# EAGLE board needles_2.5 (EAGLE 8.6.0)
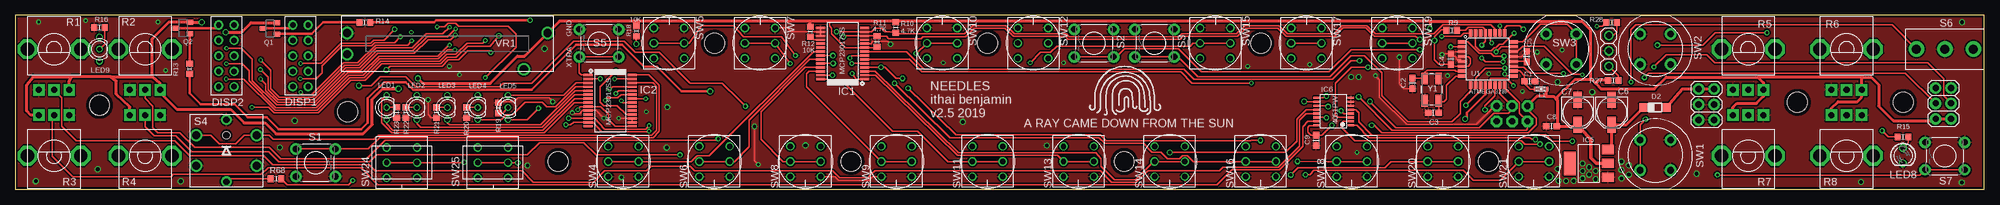
[diagram p2: board, top side]
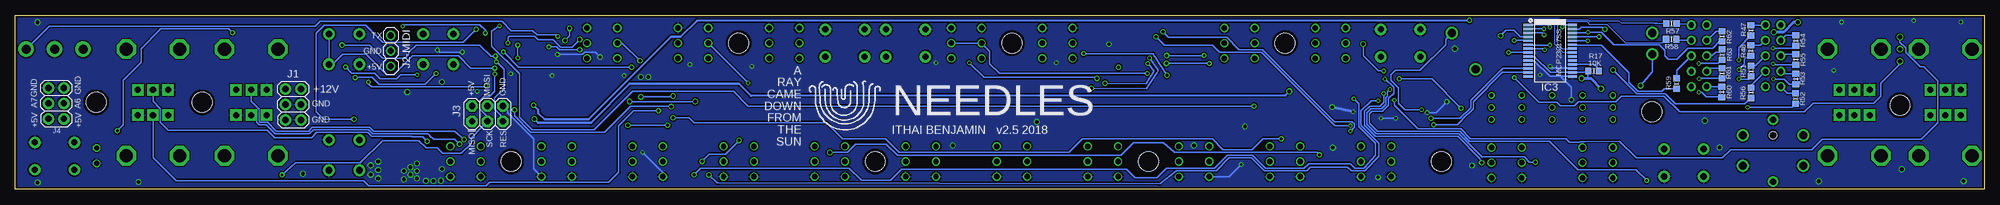
[diagram p3: board, bottom side, seen from below]

Size 324.4 x 28.7 mm. Coordinates in mm from the lower left corner, seen from the top.
Outline: 0,0 324.4,0 324.4,28.7 0,28.7 0,0
Copper layers (1*16): Top 0.0356mm / dielectric 1.5011mm / Bottom 0.0356mm
Design rules "LaenPCBOrder": minimum track width 6mil, minimum drill 13mil, track to track 6mil, track to pad 6mil, pad to pad 6mil, via to via 6mil, smd to smd 6mil, copper to edge 15mil, drill to drill 6mil, minimum pad ring 7mil, minimum via ring 7mil, stop-mask expansion 3mil, vias tented up to drill 0mil, thermal gap 10mil

## Footprints (pad centres in the part's own frame; a part is rotated, then mirrored left to right if it is on the bottom)
C0603 = smd 1.1 x 1: 1 -0.85,0; 2 0.85,0
PANASONIC_C = smd 2.6 x 1.4: + 2.05,0; - -2.05,0
SOD123 = smd 1.4 x 1.4: A 1.9,0; C -1.9,0
DISPLAY-HP_HDSP-E = drill 0.9 pad 1.5: 1 -1.27,5.08; 2 -1.27,2.54; 3 -1.27,0; 4 -1.27,-2.54; 5 -1.27,-5.08; 6 1.27,-5.08; 7 1.27,-2.54; 8 1.27,0; 9 1.27,2.54; 10 1.27,5.08
STAND-OFF = hole 3.302: 0,0
SSOP28 = smd 0.4 x 1.5: 1 -4.225,-3.625; 2 -3.575,-3.625; 3 -2.925,-3.625; 4 -2.275,-3.625; 5 -1.625,-3.625; 6 -0.975,-3.625; 7 -0.325,-3.625; 8 0.325,-3.625; 9 0.975,-3.625; 10 1.625,-3.625; 11 2.275,-3.625; 12 2.925,-3.625; 13 3.575,-3.625; 14 4.225,-3.625; 15 4.225,3.625; 16 3.575,3.625; 17 2.925,3.625; 18 2.275,3.625; 19 1.625,3.625; 20 0.975,3.625; 21 0.325,3.625; 22 -0.325,3.625; 23 -0.975,3.625; 24 -1.625,3.625; 25 -2.275,3.625; 26 -2.925,3.625; 27 -3.575,3.625; 28 -4.225,3.625
SOT223 = smd 1.499 x 2.007: 1 -2.261,-3.15; 2 0.025,-3.15; 3 2.311,-3.15 | smd 3.81 x 2.007: 4 0,3.15
TSSOP16 = smd 0.35 x 1: 1 -1.95,-2.825; 2 -1.3,-2.825; 3 -0.65,-2.825; 4 0,-2.825; 5 0.65,-2.825; 6 1.3,-2.825; 7 1.95,-2.825; 8 2.6,-2.825; 9 2.6,2.825; 10 1.95,2.825; 11 1.3,2.825; 12 0.65,2.825; 13 0,2.825; 14 -0.65,2.825; 15 -1.3,2.825; 16 -1.95,2.825
2X3 = drill 1.016 pad 1.88: 1 0,0; 2 0,2.54; 3 2.54,0; 4 2.54,2.54; 5 5.08,0; 6 5.08,2.54
1X03 = drill 1.016: 1 -2.54,0; 2 0,0; 3 2.54,0
2X3' = drill 1.016 pad 1.88 octagon: 1 0,0; 2 0,2.54; 3 2.54,0; 4 2.54,2.54; 5 5.08,0; 6 5.08,2.54
0603 = smd 0.85 x 0.7: 1 -0.9,0; 2 0.7,0
LED-BICOLOR-THROUGHHOLE = drill 0.7: 1 -2,0; 2 0,0; 3 2,0
LED3MM = drill 0.813 octagon: A -1.27,0; K 1.27,0
SOT23-3 = smd 0.8 x 1.1: 1 -0.95,-1.1; 2 0.95,-1.1; 3 0,1.2
ALPS_POT_VERTICAL = drill 1 pad 1.88 square: P$1 -2.5,6.7; P$2 0,6.7; P$3 2.5,6.7 | drill 2.2 pad 3.175 octagon: P$4 -4.4,0; P$5 4.4,0
R0603 = smd 1 x 1.1: 1 -0.85,0; 2 0.85,0
TACTILE-PTH = drill 1.016 pad 1.88: 1 -3.251,2.261; 2 3.251,2.261; 3 -3.251,-2.261; 4 3.251,-2.261
TACTILE_SWITCH_LED_PTH_12MM = drill 1.3 pad 1.93: 1 -5,2.5; 2 5,2.5; 3 -5,-2.5; 4 5,-2.5 | drill 1 pad 1.676: A 0,5.1; C 0,-5.1 | hole 1.2: 0,-2.5
ES_100SP1T6B11M2QEH_SMALL = drill 1.5 pad 2.54: O -4.7,0; P 0,0; S 4.7,0
D6R = drill 1.1 pad 1.93: A1 -2.5,2.5; A2 2.5,2.5; B1 -2.5,-2.5; B2 2.5,-2.5
LP4OA1PBCT = drill 0.9: P1 2.5,2.5; P2 0,2.5; P3 -2.5,2.5; P4 2.5,-2.5; P5 0,-2.5; P6 -2.5,-2.5
TQFP32-08 = smd 1.27 x 0.559: 1 -4.293,2.8; 2 -4.293,2; 3 -4.293,1.2; 4 -4.293,0.4; 5 -4.293,-0.4; 6 -4.293,-1.2; 7 -4.293,-2; 8 -4.293,-2.8; 17 4.293,-2.8; 18 4.293,-2; 19 4.293,-1.2; 20 4.293,-0.4; 21 4.293,0.4; 22 4.293,1.2; 23 4.293,2; 24 4.293,2.8 | smd 0.559 x 1.27: 9 -2.8,-4.293; 10 -2,-4.293; 11 -1.2,-4.293; 12 -0.4,-4.293; 13 0.4,-4.293; 14 1.2,-4.293; 15 2,-4.293; 16 2.8,-4.293; 25 2.8,4.293; 26 2,4.293; 27 1.2,4.293; 28 0.4,4.293; 29 -0.4,4.293; 30 -1.2,4.293; 31 -2,4.293; 32 -2.8,4.293
SLIDER-MEDIUM = drill 1.35: BOTTOM 16.5,1.75; P$4 12.6,-4.2; TOP -16.5,-1.75; WIPER -16.5,1.75
CRYSTAL-SMD-5X3.2-4PAD = smd 1.9 x 1.1: 1 -1.85,-1.15; 2 1.85,-1.15; 3 1.85,1.15; 4 -1.85,1.15

## Placement (x,y rotation side)
C1  100n  [C0603]  249.5,17.82 0 top
C2  22p  [C0603]  230.21,17.45 90 top
C3  22p  [C0603]  233.67,12.65 0 top
C4  100n  [C0603]  236.5,21.48 90 top
C5  100n  [C0603]  249.01,21.89 90 top
C6  22u  [PANASONIC_C]  263.01,12.7 270 top
C7  22u  [PANASONIC_C]  257.42,12.7 270 top
C8  100n  [C0603]  253.08,10.43 180 top
C9  100n  [C0603]  214.32,8.08 270 top
D2  1N5819HW  [SOD123]  270.15,13.49 0 top
DISP1  MIDI_CH  [DISPLAY-HP_HDSP-E]  47,22 0 top
DISP2  VALUES  [DISPLAY-HP_HDSP-E]  34.8,22 0 top
H1  STAND-OFF  [STAND-OFF]  89.45,4.6 0 top
H2  STAND-OFF  [STAND-OFF]  13.9,13.87 0 top
H3  STAND-OFF  [STAND-OFF]  54.76,12.8 0 top
H4  STAND-OFF  [STAND-OFF]  137.7,4.6 0 top
H5  STAND-OFF  [STAND-OFF]  242.7,4.6 0 top
H6  STAND-OFF  [STAND-OFF]  182.7,4.6 0 top
H7  STAND-OFF  [STAND-OFF]  160.2,24.1 0 top
H8  STAND-OFF  [STAND-OFF]  115.2,24.1 0 top
H9  STAND-OFF  [STAND-OFF]  205.2,24.1 0 top
H10  STAND-OFF  [STAND-OFF]  293.6,14.35 0 top
H11  STAND-OFF  [STAND-OFF]  311.05,14.35 0 top
IC1  MCP23017SS  [SSOP28]  136.33,22.38 90 top
IC2  MCP23017SS  [SSOP28]  98.02,14.63 270 top
IC3  MCP23017SS  [SSOP28]  71.52,22.86 270 bottom
IC5  REG1117  [SOT223]  259.25,4.27 90 top
IC6  4051PW  [TSSOP16]  217.2,12.5 90 top
J1  FEMALE 2x3  [2X3]  277.33,16.53 270 top
J2-MIDI  [1X03]  262.53,22.82 90 top
J3  ICSP  [2X3']  249.14,11.21 0 bottom
J4  FEMALE 2x3  [2X3]  316.38,16.71 270 top
L1  [0603]  251.28,16.54 180 top
LED1  LED-BICOLOR-THROUGHHOLE  [LED-BICOLOR-THROUGHHOLE]  61.2,13.5 90 top
LED2  LED-BICOLOR-THROUGHHOLE  [LED-BICOLOR-THROUGHHOLE]  66.2,13.5 90 top
LED3  LED-BICOLOR-THROUGHHOLE  [LED-BICOLOR-THROUGHHOLE]  71.2,13.5 90 top
LED4  LED-BICOLOR-THROUGHHOLE  [LED-BICOLOR-THROUGHHOLE]  76.2,13.5 90 top
LED5  LED-BICOLOR-THROUGHHOLE  [LED-BICOLOR-THROUGHHOLE]  81.2,13.5 90 top
LED8  [LED3MM]  311,5.55 270 top
LED9  LED-BICOLOR-THROUGHHOLE  [LED-BICOLOR-THROUGHHOLE]  13.9,23.1 90 top
Q1  [SOT23-3]  42.04,26.52 90 top
Q2  [SOT23-3]  27.68,26.57 90 top
R1  10K  [ALPS_POT_VERTICAL]  6.4,23.1 180 top
R2  10K  [ALPS_POT_VERTICAL]  21.4,23.1 180 top
R3  10K  [ALPS_POT_VERTICAL]  6.4,5.55 0 top
R4  10K  [ALPS_POT_VERTICAL]  21.4,5.55 0 top
R5  10K  [ALPS_POT_VERTICAL]  285.5,23.1 180 top
R6  10K  [ALPS_POT_VERTICAL]  301.7,23.1 180 top
R7  10K  [ALPS_POT_VERTICAL]  285.5,5.55 0 top
R8  10K  [ALPS_POT_VERTICAL]  301.7,5.55 0 top
R9  10K  [R0603]  236.66,26.2 180 top
R10  4.7K  [R0603]  145.07,26.67 90 top
R11  4.7K  [R0603]  141.99,24.35 270 top
R12  10K  [R0603]  130.98,25.97 90 top
R13  1K  [R0603]  28.74,19.87 270 top
R14  1K  [R0603]  57.61,27.51 0 top
R15  220  [R0603]  311,8.66 180 top
R16  220  [R0603]  13.89,26.67 0 top
R17  10K  [R0603]  64.36,19.53 180 bottom
R18  10K  [R0603]  102.31,26.06 90 top
R19  220ohm  [R0603]  79.6,13.43 270 top
R20  220ohm  [R0603]  74.37,12.65 90 top
R21  220ohm  [R0603]  69.39,12.65 90 top
R22  220ohm  [R0603]  64.36,12.65 90 top
R23  220ohm  [R0603]  62.83,12.66 90 top
R27  51OHM  [R0603]  263.27,17.94 180 top
R28  51OHM  [R0603]  263.01,27.47 180 top
R47  220ohm  [R0603]  38.46,26.21 270 bottom
R48  220ohm  [R0603]  38.47,22.88 270 bottom
R51  220ohm  [R0603]  38.45,19.5 270 bottom
R52  220ohm  [R0603]  31.09,14.96 270 bottom
R53  220ohm  [R0603]  31.06,18.21 270 bottom
R54  220ohm  [R0603]  31.06,24.51 270 bottom
R55  220ohm  [R0603]  31.07,21.41 270 bottom
R56  220ohm  [R0603]  38.45,15.91 90 bottom
R57  220ohm  [R0603]  51.54,27.31 180 bottom
R58  220ohm  [R0603]  51.58,24.73 180 bottom
R59  220ohm  [R0603]  50.68,17.44 270 bottom
R60  220ohm  [R0603]  43.24,16.07 270 bottom
R61  220ohm  [R0603]  43.23,19.14 270 bottom
R62  220ohm  [R0603]  43.2,25.24 270 bottom
R63  220ohm  [R0603]  43.22,22.21 270 bottom
R68  220ohm  [R0603]  42.97,1.77 180 top
S1  [TACTILE-PTH]  49.5,4.4 180 top
S2  [TACTILE-PTH]  177.7,24.1 0 top
S3  [TACTILE-PTH]  187.7,24.1 0 top
S4  [TACTILE_SWITCH_LED_PTH_12MM]  34.8,6.4 180 top
S5  [TACTILE-PTH]  96.18,24.1 0 top
S6  [ES_100SP1T6B11M2QEH_SMALL]  317.9,23.1 180 top
S7  [TACTILE-PTH]  317.9,5.5 0 top
SW1  D6R  [D6R]  270.2,5.65 90 top
SW2  D6R  [D6R]  270.2,23.1 270 top
SW3  D6R  [D6R]  254.7,23.1 270 top
SW4  LP4OA1PBCT  [LP4OA1PBCT]  100.2,4.6 90 top
SW5  LP4OA1PBCT  [LP4OA1PBCT]  107.7,24.1 270 top
SW6  LP4OA1PBCT  [LP4OA1PBCT]  115.2,4.6 90 top
SW7  LP4OA1PBCT  [LP4OA1PBCT]  122.7,24.1 270 top
SW8  LP4OA1PBCT  [LP4OA1PBCT]  130.2,4.6 90 top
SW9  LP4OA1PBCT  [LP4OA1PBCT]  145.2,4.6 90 top
SW10  LP4OA1PBCT  [LP4OA1PBCT]  152.7,24.1 270 top
SW11  LP4OA1PBCT  [LP4OA1PBCT]  160.2,4.6 90 top
SW12  LP4OA1PBCT  [LP4OA1PBCT]  167.7,24.1 270 top
SW13  LP4OA1PBCT  [LP4OA1PBCT]  175.2,4.6 90 top
SW14  LP4OA1PBCT  [LP4OA1PBCT]  190.2,4.6 90 top
SW15  LP4OA1PBCT  [LP4OA1PBCT]  197.7,24.1 270 top
SW16  LP4OA1PBCT  [LP4OA1PBCT]  205.2,4.6 90 top
SW17  LP4OA1PBCT  [LP4OA1PBCT]  212.7,24.1 270 top
SW18  LP4OA1PBCT  [LP4OA1PBCT]  220.2,4.6 90 top
SW19  LP4OA1PBCT  [LP4OA1PBCT]  227.7,24.1 270 top
SW20  LP4OA1PBCT  [LP4OA1PBCT]  235.2,4.6 90 top
SW21  LP4OA1PBCT  [LP4OA1PBCT]  250.2,4.6 90 top
SW24  LP4OA1PBCT  [LP4OA1PBCT]  63.7,4.4 90 top
SW25  LP4OA1PBCT  [LP4OA1PBCT]  78.7,4.4 90 top
U1  ATMEGA328P  [TQFP32-08]  242.6,21.49 0 top
VR1  10k  [SLIDER-MEDIUM]  71.2,24 0 top
Y1  16MHz  [CRYSTAL-SMD-5X3.2-4PAD]  233.37,16.46 270 top

## Tracks (layer width: path | path; a pad name or v marks a point on that pad's centre or on a via)
4T  (via drill 0.35)
  Top 0.254: 247,17 247,17.1 v246.8,17.1 245.71,18.29 243.09,18.29 243,18.2 U1.13 | v266.2,17.7 266.2,26.3 267,27.1 309.2,27.1 S6.S
  Bottom 0.254: v266.2,17.7 266.2,17.3 265.7,16.9 247,16.9 v246.8,17.1
+5V  (via drill 0.35, 0.51, 0.61, 0.65)
  Top 0.254: IC2.15 101.24,10.41 98.84,10.41 97.74,11.51 97.74,12.34 96.42,13.66 IC2.9 93.08,13.65 v92.71,13.11 | R11.2 141.69,23.36 IC1.9 136.79,23.36 134.52,25.63 134.52,26.57 134.16,26.92 134.16,27.74 | U1.4 239.37,21.89 239.77,21.49 239.77,20.66 239.41,20.3 U1.6 237.14,20.29 C4.1 234.53,20.63 233.83,21.34 v233.83,24.54 233.83,25.18 234.97,26.33 235.69,26.33 R9.2 | J3.2 249.14,13.19 250.59,11.73 250.59,10.67 249.27,9.35 225.14,9.35 223.93,10.56 v223.47,10.56 | v216.92,10.55 215.29,8.93 C9.1 213.47,8.93 212.95,9.45 212.95,10.21 213.25,10.52 214.34,10.52 IC6.16 | v233.07,26.52 233.07,27.71 | R18.2 102.31,27.13
  Top 0.508: R1.P$1 8.9,17.84 9.34,18.59 | 15.74,18.59 9.34,18.59 | 15.74,18.59 22.6,18.59 | 22.6,18.59 23.82,17.53 23.82,16.48 R2.P$1 23.9,15.92 26.64,13.18 35.48,13.18 37.69,10.97 41.15,10.97 42.98,9.14 57.3,9.14 58.83,10.67 58.83,14.89 60.55,16.61 v63.14,16.61 | R3.P$1 2.58,12.25 1.88,12.95 1.88,17.22 2.94,18.59 9.34,18.59 | R4.P$1 18.9,13.61 16.66,15.7 16.66,17.83 15.74,18.59 | L1.1 252.18,15.33 | 252.18,15.33 250.71,15.33 J3.2 | R6.P$1 304.2,15.2 303.48,14.48 300.3,14.48 299.21,13.39 R8.P$1 | R7.P$1 283,13.51 283.66,14.17 286.86,14.17 288,15.31 R5.P$1 288,17.6 287.1,18.5 | 130.98,27.74 134.16,27.74 144.85,27.74 R10.2 145.25,27.71 233.07,27.71 258.09,27.71 259.61,26.19 259.61,18.21 | 22.6,18.59 22.6,24.81 25.38,27.58 28.61,27.58 Q2.2 v30.72,27.52 v30.73,27.53 | 254.1,14.71 254.1,15.24 257,18.14 259.54,18.14 259.61,18.21 | 254.1,14.71 254.1,10.41 254.04,10.34 C8.1 257.21,10.43 C7.+ | 252.18,15.33 253.48,15.33 254.1,14.71 | R6.P$1 304.2,17.43 | 263.79,16.57 264.16,16.57 | 264.16,16.57 270.06,16.57 271.99,18.5 287.1,18.5 | J4.6 J4.5 316.08,11.33 309.42,11.33 307.01,13.74 307.01,17.25 305.75,18.5 304.39,18.5 | v34.67,25.91 37.31,25.91 38.86,27.46 43.13,27.46 Q1.2 | v66.34,18.29 67.15,17.48 78.26,17.48 82.73,21.95 83.9,21.95 VR1.BOTTOM 89.69,27.74 102.34,27.74 | 130.98,27.74 102.34,27.74 | R12.2 130.98,27.74 | 102.34,27.74 102.31,27.71 R18.2 | 304.39,18.5 287.1,18.5 | R6.P$1 304.2,18.31 304.39,18.5 | 264.16,16.57 264.15,16.56 261.26,16.56 260.36,17.46 | 260.36,17.46 259.61,18.21 | R27.2 260.85,17.95 260.36,17.46
  Top 0.61: C7.+ 259.58,8.18 259.58,5.18 260.47,4.29 IC5.2
  Bottom 0.254: IC3.9 74.09,21.89 71.48,19.28 IC3.16 | IC3.16 65.88,19.29 65.42,19.45 | 65.42,19.45 R17.2 | v92.71,13.11 95.45,13.11 96.52,14.17 96.52,16.76 97.74,17.98 97.74,18.9 97.03,19.61 92.96,19.61 88.74,23.83 88.74,24.71 VR1.BOTTOM | v223.47,10.56 v216.92,10.55 | v233.83,24.54 233.07,25.3 v233.07,26.52 | 65.28,18.29 65.28,19.3 65.42,19.45
  Bottom 0.406: IC3.16
  Bottom 0.508: v66.34,18.29 65.28,18.29 64.82,18.29 v63.14,16.61 | v30.73,27.53 31.44,27.53 33.05,25.92 34.66,25.92 v34.67,25.91
A
  Top 0.254: SW6.P2 SW6.P5 118.49,4.6 120.9,7.01 120.9,11.43 130.88,21.41 IC1.23
A4  (via drill 0.38, 0.51)
  Top 0.254: SW18.P5 SW18.P2 216.17,4.6 v211.25,4.62 | v147.11,16.66 154.96,8.97 178.77,8.97 179.68,8.05 203.58,8.05 203.6,8.08 v205.13,8.08 | 139.94,22.05 IC1.7 137.87,22.06 v137.53,21.65
  Bottom 0.254: v147.11,16.66 138.02,16.62 137.43,17.46 137.13,17.95 136.27,19.24 136.26,19.24 136.27,19.25 136.45,18.95 136.33,19.15 136.15,19.44 136.14,19.7 v137.53,21.65 | v137.53,21.65 137.49,21.66 137.51,21.64 | 137.51,21.65 v137.53,21.65 | v205.13,8.08 205.13,8.05 207.39,5.79 210.07,5.79 v211.25,4.62
A#  (via drill 0.43, 0.51)
  Top 0.254: SW7.P5 SW7.P2 | SW7.P2 | SW7.P2 v127.67,20.75 | v134.77,20.76 IC1.24
  Bottom 0.203: 134.78,20.75 v134.77,20.76
  Bottom 0.254: v127.67,20.75 134.78,20.75
A#4  (via drill 0.51)
  Top 0.254: SW19.P2 SW19.P5 | IC1.8 145.89,22.71 146.8,22.71 149.7,19.81 192.53,19.81 194.15,18.19 217.03,18.19 220.03,21.18 v221.49,21.18
  Bottom 0.254: v221.49,21.18 224.4,24.1 SW19.P5
ADC6  (via drill 0.45)
  Top 0.254: U1.19 247.04,20.14 248.54,20.14 249.58,19.1 v255.04,19.1 | v268.4,18.41 269.14,19.15 311.4,19.15 J4.3
  Bottom 0.254: v268.4,18.41 268.5,18.41 268.53,18.44 265.6,18.44 264.46,17.31 256.84,17.31 v255.04,19.1
ADC7  (via drill 0.35, 0.45)
  Top 0.254: U1.22 247.41,22.69 248.34,23.62 251.89,23.62 256.51,19 258.06,19 v258.17,18.9 | v269.98,20.17 269.98,20.19 271.98,22.2 278.69,22.2 280.01,20.88 315.09,20.88 317.7,18.26 317.7,15.39 J4.4
  Bottom 0.254: v258.17,18.9 260.88,18.9 261.54,18.24 264.31,18.24 265.2,19.13 268.94,19.13 v269.98,20.17
AREF
  Top 0.254: U1.20 248.96,21.09 C5.1
ARP_LED  (via drill 0.35)
  Top 0.254: v97.2,14.71 97.58,15.09 99.26,15.09 99.78,15.61 IC2.23
  Bottom 0.254: 97.28,14.78 v97.2,14.71 97.2,13.84 93.32,9.96 86.26,9.96 84.64,8.33 84.63,8.33 68.92,8.33 68.36,7.78 68.17,7.77 66.65,7.8 66.59,7.85 65.81,7.85 65.77,7.82 60.09,7.92 57.35,5.18 43.13,5.18 41.76,6.55 28.39,6.55 26.72,8.23 10.41,8.23 7.68,10.96 7.68,17.91 9.97,20.2 10.57,20.2 12.96,22.6 12.96,23.31 13.9,24.24 LED9.3
B
  Top 0.254: IC1.25 132.33,20.1 130.15,20.1 122.86,12.82 122.86,8.25 126.51,4.6 SW8.P2 SW8.P5
B4  (via drill 0.35, 0.51)
  Top 0.254: SW20.P5 SW20.P2 226.67,4.6 225.68,3.61 211.35,3.61 v210.13,2.39 | IC2.21 100.17,14.31 v99.86,14.62
  Bottom 0.254: v99.86,14.62 101,14.62 102.66,12.95 102.66,10.53 99.72,7.58 99.72,5.49 102,3.05 102.3,3.05 102.31,3.05 104.29,3.05 104.89,3.66 111,3.66 111.6,3.05 118.62,3.05 120.75,5.18 124.41,5.18 126.54,3.05 133.09,3.05 133.1,3.05 135.84,0.91 208.51,1.06 208.81,1.06 v210.13,2.39
C
  Top 0.254: SW9.P5 SW9.P2 130.35,16.95 130.35,19.05 130.76,19.46 IC1.26
C4  (via drill 0.35, 0.51)
  Top 0.254: SW21.P5 SW21.P2 244.65,1.55 240.23,1.55 238.61,3.17 214,3.17 213.26,2.44 v212.57,2.44 | IC2.22 101.66,14.94 v103.88,14.94
  Bottom 0.254: v103.88,14.94 103.07,14.13 103.07,10.36 100.28,7.57 100.28,5.64 102.1,3.61 102.2,3.5 103.68,3.5 104.44,4.27 111.3,4.27 112.06,3.5 118.46,3.5 120.6,5.64 124.71,5.64 126.84,3.5 134.72,3.5 136.29,1.93 139.9,1.93 141.32,3.35 178.36,3.35 180.18,1.47 184.99,1.47 187.04,3.5 211.5,3.5 v212.57,2.44
C#  (via drill 0.41, 0.51)
  Top 0.254: SW10.P2 SW10.P5 v148.4,22.38 | v134.66,18.8 IC1.27
  Bottom 0.254: v148.4,22.38 136.95,22.35 136.7,21.95 136.65,21.84 v134.66,18.8
D
  Top 0.254: SW11.P5 SW11.P2 153.64,4.6 148.64,9.6 144.52,9.6 136.6,17.53 134.46,17.53 133.85,18.14 132.72,18.14 IC1.28
D10  (via drill 0.51)
  Top 0.254: U1.14 243.8,15.46 242.15,13.8 v242.15,13.13 | IC6.11 216.15,13.8 v216.3,13.65
  Bottom 0.254: v216.3,13.65 216.38,13.73 223.01,13.73 227.29,9.45 239.5,9.45 242.15,12.1 242.15,12.66 v242.15,13.13
D#  (via drill 0.38)
  Top 0.254: v137.87,19.1 138.5,18.16 IC1.1
  Bottom 0.254: v137.87,19.1 162.25,19.1 163.88,20.73 163.88,22.78 SW12.P5 SW12.P2
E
  Top 0.254: SW13.P5 SW13.P2 171.69,5.62 155.28,5.62 155.28,5.63 141.77,18.81 IC1.2
EUC_LED  (via drill 0.35)
  Top 0.254: v77.44,18.41 82.49,23.46 82.49,25.58 81.22,26.84 73.06,26.84 72.54,27.36 71.31,27.36 70.73,26.77 v69.52,26.77
  Bottom 0.254: LED9.1 13.9,20.62 17.07,17.45 17.07,15.37 18.21,14.22 28.19,14.22 29.64,12.78 50.16,12.78 52.76,15.38 59.8,15.38 60.71,14.48 66.85,14.48 67.54,13.79 69.85,13.79 70.43,14.38 73.41,14.38 v77.44,18.41 | IC3.28 69.21,27.09 v69.52,26.77
F
  Top 0.254: 189.18,4.6 SW14.P5 SW14.P2 187.56,4.6 184.58,1.63 181.1,1.63 178.88,3.84 178.88,5.09 178.07,6.02 155.44,6.03 141.69,19.45 IC1.3
F#  (via drill 0.35, 0.51)
  Top 0.254: SW15.P2 SW15.P5 194.05,24.09 193.58,23.62 171.65,23.62 170.58,22.55 168.91,22.55 v167.23,20.88 | IC1.4 v142.64,20.12 143.3,20.12 145.13,18.29 v146.2,18.29
  Bottom 0.254: v146.2,18.29 146.35,18.44 164.79,18.44 v167.23,20.88
G
  Top 0.203: IC1.21
  Top 0.254: IC1.21 131.49,22.7 114.34,5.55 112.31,5.55 111.35,4.6 SW4.P5 SW4.P2
G4  (via drill 0.38, 0.51)
  Top 0.254: SW16.P5 SW16.P2 194.11,4.59 193.69,5 193.09,5.55 192.31,5.55 191.78,5.03 189.85,5.03 188.74,6.15 187.31,6.15 185.86,7.59 179.53,7.59 178.58,8.53 154.02,8.53 v144.88,17.48 | v137.81,20.75 IC1.5
  Bottom 0.254: v144.88,17.48 138.1,17.42 136.76,19.44 137.63,20.59 v137.81,20.75
G#  (via drill 0.43, 0.51)
  Top 0.203: v134.71,22.05 133.41,22.05
  Top 0.254: SW5.P5 SW5.P2 111,24.1 113.11,26.98 118.31,26.98 120,25.13 120.6,25.13 126.25,25.13 v128.54,22.06 | 133.41,22.05 IC1.22
  Bottom 0.254: v128.54,22.06 v134.71,22.05
G#4  (via drill 0.35)
  Top 0.254: SW17.P2 SW17.P5 | IC1.6 145.44,21.41 147.35,21.41 149.4,19.36 192.07,19.36 193.9,17.53 v203.65,17.53
  Bottom 0.254: SW17.P5 203.65,17.55 v203.65,17.53
GND  (via drill 0.35, 0.36, 0.4, 0.41, 0.46, 0.51, 0.55, 0.6, 0.65)
  Top 0.254: IC2.16 IC2.17 99.44,11.71 v99.41,11.73 | v91.79,12.65 91.97,12.47 92.97,12.47 93.5,13.01 IC2.10 95.7,13.01 v96.97,11.73 | SW7.P3 127.23,26.6 127.87,25.96 IC1.16 | IC1.15 IC1.16 | IC1.16 IC1.17 | SW8.P6 135.04,2.1 135.64,1.5 140.65,1.5 141.25,2.1 SW9.P3 | C4.2 237.17,22.69 U1.3 | U1.5 238.06,21.34 237.55,21.34 237.39,21.5 237.39,21.75 C4.2 | R21.1 68.56,11.8 68.02,12.34 v68.02,14.78 | C4.2 236.27,22.33 | v144.22,23.93 143.76,24.38 141.35,24.38 140.97,24.01 IC1.10 | C4.2 235.13,22.33 v235.05,22.25 | C2.1 228.81,16.6 228.04,17.37 v228.04,21.79 | v224.08,18.75 224.74,18.09 224.74,15.22 229.24,10.72 240.75,10.72 243.78,13.75 J3.6 | v122.42,4.12 121.81,4.72 v121.81,10.36 | U1.21 248.16,21.89 C5.2 | 79.75,14.43 82.23,14.43 82.88,15.09 87.93,15.09 v88.57,14.45
  Top 0.508: R19.1 79.75,14.43
  Bottom 0.254: IC3.10 74.2,21.23 71.6,18.64 69.85,18.64 | 69.85,18.64 IC3.15 | v99.41,11.73 v96.97,11.73 96.82,11.73 | v68.02,14.78 68.02,16.81 69.85,18.64 | SW20.P6 239.01,3.41 239.01,8.38 243.28,12.65 243.28,12.97 J3.6 | v228.04,21.79 228.8,22.55 230.59,22.55 230.9,22.25 v235.05,22.25 | SW18.P3 217.7,2.77 v221.03,6.1 | SW8.P3 124.44,2.1 v122.42,4.12 | v250.7,22.6 254.46,22.6 v254.81,22.96 | v88.57,14.45 90.37,12.65 v91.79,12.65
  Bottom 0.305: IC3.17 71.19,19.93 v71.52,20.27 71.68,20.42
  Bottom 0.508: v103.98,12.8 v107.44,13.56
  other vias: 258.21,4.27 258.21,3.05 258.21,1.83 259.28,3.66 259.28,2.44 264.61,4.57 264.61,3.2 264.61,1.83 304.09,1.22 277.01,2.59 265.83,2.44 265.83,3.96 254.1,17.68 220.09,18.51 221.31,18.51 87.23,23.18 73.2,18.9 3.86,27.58 23.52,27.58 11.63,27.81 3.4,1.37 27.3,1.35 156.11,11.13 260.35,1.68 260.35,3.05 254.26,1.43 254.1,3.35 259.81,16.03 248.31,16.15 213.26,20.57 203.04,20.27 172.72,20.88 152.9,20.88 46.07,11.3 235.96,18.75 256.74,1.41 255.5,1.4 99.87,1.98 84.42,3.92 43.62,6.92 169.92,7.22 242.76,19.05 320.71,1.13 320.73,27.53 13.61,3.33 24.79,19.61 130.2,7.26 107.34,6.88
  pour Top (isolate 0.254): 0,28.7 324.4,28.7 324.4,0 0,0
  pour Bottom (isolate 0.203): 0,0 0,28.7 324.4,28.7 324.4,0
LEG_LED  (via drill 0.41, 0.45, 0.51)
  Top 0.254: U1.1 239.32,24.29 241.21,22.4 243.13,22.4 243.58,21.95 v245.26,21.95 | v270.56,23.77 278.02,23.77 280.08,25.83 280.11,25.81 v288.6,25.81 | v307.57,9.65 308.56,8.66 R15.2
  Bottom 0.254: v245.26,21.95 246.02,21.95 247.85,23.77 258.37,23.77 259.58,22.55 259.58,22.25 260.19,21.64 263.85,21.64 265.99,23.77 v270.56,23.77 | v288.6,25.81 289.23,26.44 300.41,26.44 303.66,23.19 303.66,20.95 306.6,18.01 306.6,10.62 v307.57,9.65
MCP_SCL  (via drill 0.35, 0.41, 0.45, 0.46, 0.51)
  Top 0.254: v104.44,10.52 103.85,9.93 101.55,9.93 99.45,9.92 99.25,9.92 97.12,9.92 95.47,11.71 IC2.12 v91.18,11.73 | v231.39,24.69 230.69,25.24 223.89,25.24 222.53,26.59 218.77,26.59 217.41,25.24 209.39,25.24 208.06,26.57 202.76,26.57 201.38,25.2 192.39,25.2 191.93,24.73 173.47,24.73 173.01,25.2 164.47,25.2 163.1,26.57 157.99,26.57 156.56,25.15 149.55,25.15 149.25,24.84 143.91,24.84 143.55,25.2 R11.1 141.73,25.31 IC1.12 136.61,25.31 v136.45,25.15 | U1.28 243,24.34 v243.23,24.11
  Bottom 0.254: v136.45,25.15 135.07,23.77 127.15,23.77 125.98,22.61 119.09,22.61 107,10.52 v104.44,10.52 | IC3.12 76.86,19.94 79.35,19.94 84.61,14.68 84.61,13.47 86.36,11.72 89.97,11.73 v91.18,11.73 | v231.39,24.69 232.66,23.42 234.54,23.42 235.81,24.69 238.28,24.69 238.81,25.22 243,25.22 243.23,25 v243.23,24.11
MCP_SDA  (via drill 0.35, 0.45, 0.46)
  Top 0.254: 99.09,9.52 99.08,9.52 96.64,9.52 95.24,11.06 IC2.13 91.96,11.05 91.49,10.67 v90.73,10.67 | 99.09,9.52 | 99.09,9.52 99.24,9.52 99.64,9.52 101.55,9.52 104.34,9.52 104.42,9.6 v104.44,9.6 | 139.98,25.96 IC1.13 | IC1.13 141.07,25.96 141.63,26.52 142.74,26.52 143.3,25.96 144.12,25.96 R10.1 145.28,25.6 156.41,25.6 157.78,26.98 163.27,26.98 164.64,25.6 173.17,25.6 173.63,25.15 173.94,25.15 173.94,25.14 191.76,25.14 192.22,25.6 201.22,25.6 202.59,26.98 208.23,26.98 209.56,25.65 217.25,25.65 218.6,27 222.7,27 224.05,25.65 233.72,25.65 235.2,27.13 243.13,27.13 243.8,26.46 U1.27 | IC1.13 v135.31,25.96 v135.31,25.95
  Bottom 0.254: v104.44,9.6 104.44,9.62 103.81,10.25 103.81,10.78 104.18,11.15 107.06,11.15 118.92,23.01 122.76,23.01 124.81,25.05 126.17,25.05 126.18,25.06 134.38,25.06 v135.31,25.95 | IC3.13 76.56,19.3 79.36,19.3 84.2,14.45 84.2,13.3 85.95,11.55 86.07,11.43 86.84,10.67 v90.73,10.67
MIDI_CH
  Top 0.254: S1.4 S1.3 58.17,6.66 60.05,8.53 105.05,8.53 106.07,9.55 106.07,17.13 104.33,18.87 101.65,18.87 IC2.28
MIDI_CH_COM  (via drill 0.5, 0.51)
  Top 0.406: R14.2 68.99,27.51 69.33,27.86 71.47,27.86 74.4,27.84 84.84,27.84 v84.85,27.85 | v239.01,13.87 241.4,16.25 U1.11
  Bottom 0.254: v239.01,13.87 239.16,14.02
  Bottom 0.406: v84.85,27.85 212.09,27.8 214.76,25.13 216.32,25.13 229.92,11.53 237.21,11.53 238.25,12.57 238.25,13.11 v239.01,13.87
MIDI_OUT  (via drill 0.35, 0.46)
  Top 0.254: v246.94,25.76 245.08,23.9 244.5,23.9 243.92,23.33 243.68,23.33 243.23,22.87 241.31,22.87 240.6,23.59 U1.31 | R28.2 261.98,27.4 261.44,26.86 v260.58,26.86
  Bottom 0.254: 246.94,25.6 v246.94,25.76 246.94,26.21 247.85,27.13 260.31,27.13 v260.58,26.86
MISO  (via drill 0.51)
  Top 0.254: U1.16 245.4,16.68 247.82,14.26 247.82,12.53 J3.1 249.14,9.98 248.92,9.75 230.32,9.75 226.82,9.75 v221.33,15.24 | v216,15.39 215.54,15.09 214.39,15.09 IC6.9
  Bottom 0.254: v221.33,15.24 216.3,15.24 v216,15.39
MOSI  (via drill 0.51, 0.6)
  Top 0.254: U1.15 244.6,15.76 J3.4 246.61,13.13 246.01,12.53 243.62,12.53 241.25,10.16 227.48,10.16 v223.16,14.48 | v212.34,14.48 214.35,14.48 IC6.10
  Bottom 0.254: v223.16,14.48 v212.34,14.48 212.19,14.48
N$1
  Top 0.254: R12.1 131.64,24.66 IC1.18
N$2  (via drill 0.45, 0.55)
  Top 0.254: IC2.18 100.63,12.36 99.19,13.8 96.91,13.8 96.36,14.34 96.36,16.92 v98.95,19.51 | R18.1 102.31,25.74 v102.31,23.93
  Bottom 0.254: 98.8,19.36 v98.95,19.51 99.82,19.51 102.31,21.99 v102.31,23.93
N$3
  Top 0.254: L1.2 249.64,16.52 248.65,17.51 C1.1 248.65,18.71 247.85,19.51 246.9,19.51 U1.18
N$4
  Top 0.254: R23.2 LED1.2
N$5
  Top 0.254: C2.2 Y1.1 232.22,19.27 232.61,19.66 237.17,19.66 237.33,19.49 U1.7
N$6
  Top 0.254: C3.2 Y1.3 234.37,14.45 235.4,14.45 235.81,14.86 235.81,17.17 237.31,18.68 238.29,18.68 U1.8
N$7
  Top 0.254: R22.2 66.22,13.52 LED2.2
N$8
  Bottom 0.254: IC3.18 64.27,20.59 63.34,19.66 63.34,19.25
  Bottom 0.406: 63.34,19.25 R17.1
N$9
  Top 0.254: R21.2 LED3.2
N$10
  Top 0.254: R20.2 LED4.2
N$11
  Top 0.254: R19.2 80.28,12.58 LED5.2
N$12
  Top 0.254: R68.2 35.27,1.77 S4.A
N$13
  Top 0.254: J2-MIDI.1 264.12,18.68 R27.1
N$17
  Top 0.406: R14.1 50.72,27.51 48.86,25.65 43.22,25.65 Q1.1
N$18
  Top 0.254: J2-MIDI.3 263.31,25.36 263.86,25.91 R28.1
N$20
  Top 0.406: R13.1 28.74,25.59 Q2.1
N$21
  Top 0.254: LED8.A 311.85,7.67 R15.1
N$22
  Top 0.406: DISP2.1 33.02,26.57 Q2.3
N$23
  Top 0.254: LED9.2 14.74,23.94 R16.2
N$29
  Bottom 0.254: R47.1 38.44,27.08 DISP2.10
N$30
  Bottom 0.254: DISP2.9 36.88,23.73 R48.1
N$31
  Bottom 0.254: DISP2.8 37.72,20.35 R51.1
N$32
  Bottom 0.254: R52.1 32.42,15.81 DISP2.5
N$33
  Bottom 0.254: R53.1 33.13,19.06 DISP2.4
N$34
  Bottom 0.254: R54.1 32.71,25.36 DISP2.2
N$35
  Bottom 0.254: R55.1 33.27,22.26 DISP2.3
N$36
  Bottom 0.203: R57.1 48.49,27.3 DISP1.10
N$37
  Bottom 0.254: DISP2.7 38.45,17.09 R56.2
N$38
  Top 0.406: Q1.3 45.17,26.52 DISP1.1
N$39
  Bottom 0.254: DISP1.9 50.54,24.54 R58.1
N$40
  Bottom 0.254: R59.1 50.68,19.59 DISP1.8
N$41
  Bottom 0.254: R60.1 DISP1.5
N$42
  Top 0.508: J1.1 274.63,16.53 | 274.63,16.53 D2.A | J1.2 J1.1 | J1.1 274.63,16.53
N$43
  Bottom 0.254: R61.1 45.2,19.99 DISP1.4
N$44
  Bottom 0.254: R62.1 44.18,26.09 DISP1.2
N$45
  Bottom 0.254: DISP1.3 44.88,22 44.25,22.63 43.65,22.63 R63.1
OCT_DOWN  (via drill 0.35, 0.51)
  Top 0.254: SW24.P2 SW24.P5 73.89,4.4 v73.96,4.47 | IC2.25 98.39,16.91 v97.94,16.46
  Bottom 0.254: v73.96,4.47 74.92,4.47 75.81,5.35 82.73,5.35 82.77,5.32 82.81,5.4 82.88,5.43 86.59,9.14 100.13,9.14 101.71,10.72 101.71,12.64 101.09,13.26 99.31,13.26 98.55,14.02 98.55,15.16 98.32,15.38 98.32,16.07 v97.94,16.46
OCT_LED1  (via drill 0.45, 0.46)
  Top 0.254: v96.41,18.22 94.41,18.22 IC2.2 | LED5.1 84.33,11.5 v86.21,13.38
  Bottom 0.254: v96.41,18.22 v96.4,18.22 91.04,18.22 v86.21,13.39 v86.21,13.38
OCT_LED2
  Top 0.254: LED5.3 90.32,15.5 92.37,17.55 IC2.3
OCT_LED3
  Top 0.254: LED4.1 80.06,11.5 80.87,12.31 81.66,12.31 81.93,12.31 84,14.38 86.79,14.38 87.53,13.64 89.04,13.64 92.29,16.9 94.38,16.9 IC2.4
OCT_LED4
  Top 0.254: LED3.1 71.2,10.99 71.57,10.62 86.59,10.62 92.23,16.25 IC2.5
OCT_LED5
  Top 0.254: LED2.1 66.2,10.81 66.8,10.21 86.8,10.21 92.19,15.6 IC2.6
OCT_LED6
  Top 0.254: LED1.1 61.2,10.78 62.23,9.75 86.92,9.75 92.12,14.96 IC2.7
OCT_LED7
  Top 0.254: IC2.8 92.07,14.3 87.12,9.35 62.02,9.35 60.39,10.98 60.39,14.69 LED1.3
OCT_UP  (via drill 0.35, 0.51)
  Top 0.254: SW25.P2 SW25.P5 82.22,4.4 v82.8,4.39 | IC2.24 99.41,16.26 v98.95,15.8
  Bottom 0.254: v82.8,4.39 83.11,5.08 86.76,8.74 100.3,8.74 102.11,10.56 102.11,12.84 101.24,13.72 99.56,13.72 98.95,14.33 v98.95,15.8
OSC  (via drill 0.35)
  Top 0.254: U1.32 239.71,25.7 238.7,25.7 238.2,25.2 v235,25.2
  Bottom 0.254: v235,25.2 235.25,25.45 238.4,25.45 239.13,26.18 242.68,26.18 244.17,27.66 274.19,27.66 274.98,26.87 318.83,26.87 S6.O
POT_MUX  (via drill 0.41, 0.51)
  Top 0.254: U1.23 244.83,23.49 v243.95,22.67 | IC6.3 220.01,11.87 217.87,11.87 217.5,12.24 217.5,17.5 220.11,20.12 v222.86,20.12
  Bottom 0.254: v222.86,20.12 241.45,20.12 v243.95,22.67 243.96,22.66
POT_VAL_COM  (via drill 0.55, 0.6)
  Top 0.406: v114.5,16.15 109.78,16.15 105.71,20.22 103.63,20.22 100.03,23.82 92.41,23.82 85.04,16.46 65.58,16.46 64.36,17.68 60.76,17.68 58.06,14.99 58.06,14.78 58.06,10.97 57,9.91 43.43,9.91 41.45,11.89 38.3,11.89 36.17,14.02 30.58,14.02 28.74,15.86 R13.2 | U1.12 242.2,15.68 239.16,12.65 239.16,11.89 v238.86,11.58
  Bottom 0.406: v114.5,16.15 115.11,15.54 203.2,15.41 205.17,17.38 223.15,17.38 229.56,10.97 238.25,10.97 v238.86,11.58
RESET  (via drill 0.41, 0.46)
  Top 0.254: v245.11,21.03 242.21,21.03 v241.6,21.64 | v241.6,23.77 242.2,24.37 U1.29 242.2,26.3 241.79,26.7 239.4,26.7 238.9,26.2 R9.1
  Bottom 0.254: J3.5 244.06,11.91 245.39,13.24 245.38,13.25 245.38,15.12 243.89,16.61 243.89,19.81 v245.11,21.03 | v241.6,21.64 v241.6,23.77
REST  (via drill 0.41)
  Top 0.254: 240.6,17.31 U1.10 | 240.6,17.31 240.69,17.37 | v245.41,19.96 242.18,19.96 240.6,18.39 240.6,17.32 240.6,17.31
  Bottom 0.254: SW2.A1 SW2.A2 272.14,20.6 270.49,22.25 266.6,22.25 263.24,18.9 262.05,18.9 261.9,19.05 258.95,22 251.36,22 249.33,19.96 v245.41,19.96
SCK  (via drill 0.41, 0.45)
  Top 0.254: v245.38,19 245.68,18.7 245.72,18.69 U1.17 | v280.44,2.4 280.5,2.34 313.75,2.34 S7.3 S7.4
  Bottom 0.254: v245.38,19 245.38,18.32 245.38,16.15 246.29,15.24 247.24,15.24 247.85,14.63 247.85,13.26 246.6,12.01 J3.3 246.96,10.85 | 246.96,10.85 248.42,9.39 248.42,9.34 249.3,8.46 249.3,7.54 250.9,5.94 253.97,5.94 254.87,6.85 256.7,6.85 257.91,8.05 263.88,8.05 267.54,4.39 278.22,4.39 280.41,2.4 v280.44,2.4 | 246.96,11 246.96,10.85
SEG1_A
  Bottom 0.203: IC3.21 69.37,22.54 70.72,23.88 70.72,27.08 69.86,27.94 65.28,27.94 65.08,27.74 60.1,27.74 59.72,27.36 54.28,27.34 | 53.9,27.34 54.28,27.34 | 54.28,27.34 52.42,27.34 R57.2
SEG1_B
  Bottom 0.203: IC3.22 69.05,23.19 69.52,23.19 70.36,24.03 70.36,26.94 69.71,27.58 65.43,27.58 64.97,27.13 62.1,27.13 59.16,24.18 52.98,24.18 R58.2
SEG1_C
  Bottom 0.254: IC3.23 67.67,23.84 67.58,23.75 63.09,23.75 58.52,19.18 58.52,17.65 57.06,16.19 53.11,16.19 52.71,16.59 R59.2
SEG1_D  (via drill 0.35)
  Top 0.254: v65.34,24.48 64.63,23.77 59.36,23.77 56.42,20.83 54.09,20.83 48.88,15.62 47.42,15.62 v47.04,16
  Bottom 0.254: v65.34,24.48 IC3.24 | v47.04,16 46.53,16 45.8,15.27 43.29,15.27 R60.2
SEG1_E  (via drill 0.35, 0.4)
  Top 0.254: v63.45,25.15 62.48,24.18 59.2,24.18 58.69,23.67 53.9,23.67 50.57,20.34 50.57,19.2 49.61,18.24 v46.99,18.24
  Bottom 0.254: v63.45,25.15 IC3.25 | R61.2 46.94,18.29 v46.99,18.24
SEG1_F  (via drill 0.35)
  Bottom 0.254: IC3.26 65.36,25.79 v65.28,25.87 63.11,25.87 61.04,23.8 53.52,23.8 52.65,22.94 52.65,22.05 52.02,21.41 50.67,21.41 48.82,23.27 44.76,23.27 43.63,24.39 R62.2
SEG1_G  (via drill 0.35, 0.45)
  Top 0.254: v62.53,26.36 60.75,24.58 59.03,24.58 58.52,24.08 53.73,24.08 50.4,20.75 v47.04,20.75
  Bottom 0.178: 67.85,26.42 IC3.27
  Bottom 0.254: v62.53,26.36 62.91,26.75 66.37,26.75 66.75,26.42 67.85,26.42 | R63.2 43.81,20.77 43.89,20.77 43.91,20.75 v47.04,20.75
SEG2_A  (via drill 0.35)
  Top 0.254: v71.58,26.73 70.45,25.6 70.3,25.6 70,25.6 69.5,25.6 67.71,25.6 65.43,23.32 59.48,23.32 56.59,20.42 54.82,20.42 54.81,20.41 54.25,20.41 49.05,15.21 43.51,15.21 42.11,16.61 42.11,19.65 v40.45,21.31
  Bottom 0.254: IC3.1 71.93,27.09 v71.58,26.73 | R47.2 40.45,23.37 v40.45,21.31
SEG2_B  (via drill 0.35)
  Top 0.254: v72.56,26.44 71.27,25.15 67.87,25.15 65.52,22.8 59.54,22.8 56.76,20.02 54.99,20.02 54.98,20.01 54.41,20.01 49.22,14.81 43.34,14.81 41.7,16.44 41.7,18.44 v40.41,19.74
  Bottom 0.254: v72.56,26.44 75.23,26.43 IC3.2 | R48.2 39.56,21.55 39.56,20.59 v40.41,19.74
SEG2_C  (via drill 0.35)
  Top 0.254: v72.53,25.45 71.77,24.69 68.02,24.69 65.72,22.39 59.71,22.39 56.92,19.6 54.58,19.6 49.33,14.35 43.22,14.35 41.3,16.27 41.3,17.35 v40.46,18.19
  Bottom 0.254: IC3.3 72.86,25.79 v72.53,25.45 | R51.2 38.91,18.19 v40.46,18.19
SEG2_D  (via drill 0.35, 0.5)
  Top 0.254: v79.68,25.33 78.23,23.62 74.57,23.62 72.68,21.73 71.12,21.73 70.08,20.69 60.41,20.69 57.7,17.98 55.26,17.98 49.91,12.62 42.65,12.62 41.73,13.54 v39.01,13.54
  Bottom 0.254: IC3.4 76.39,25.14 77.47,26.21 78.84,26.21 79.68,25.37 v79.68,25.33 | R52.2 31.66,13.54 v39.01,13.54
SEG2_DP  (via drill 0.4, 0.6)
  Top 0.254: v61.16,19.66 61.79,20.29 70.32,20.29 71.36,21.33 73.04,21.33 74.55,22.84 78.1,22.84 v78.38,22.55
  Bottom 0.254: 61.31,19.81 v61.16,19.66 61.1,19.66 57.23,15.79 52.59,15.79 50.88,14.07 39.44,14.07 R56.1 | v78.38,22.55 75.17,22.55 IC3.8
SEG2_E  (via drill 0.35, 0.45)
  Top 0.254: v77.47,24.54 77.01,24.08 74.42,24.08 72.59,22.25 71.07,22.25 69.92,21.1 60.24,21.1 57.53,18.38 55.09,18.38 49.74,13.03 42.82,13.03 37.66,18.19 36.88,18.19 v34.77,18.19
  Bottom 0.254: v77.47,24.54 75.2,24.54 IC3.5 | R53.2 32.14,17.36 32.97,18.19 v34.77,18.19
SEG2_F  (via drill 0.35)
  Top 0.254: v71.57,23.77 71.41,23.77 69.58,21.95 59.94,21.95 57.19,19.19 54.75,19.19 49.48,13.92 43.08,13.92 39.06,17.93 39.06,19.91 | 39.06,19.91 39.06,20.45 | v34.82,23.27 37.26,23.27 39.06,21.46 39.06,19.91
  Bottom 0.254: v71.57,23.77 75.09,23.77 IC3.6 | R54.2 31.46,23.27 v34.82,23.27
SEG2_G  (via drill 0.35)
  Top 0.254: v72.44,23.01 71.22,23.01 69.71,21.51 60.08,21.51 57.36,18.79 54.92,18.79 49.62,13.49 42.94,13.49 38.56,17.86 38.56,19.56 37.41,20.7 v34.8,20.7
  Bottom 0.254: v72.44,23.01 72.57,23.01 72.74,23.18 IC3.7 | IC3.7 | R55.2 34.65,20.56 v34.8,20.7
SHIFT_BUTT
  Top 0.254: IC2.26 105.06,17.55 105.66,16.95 105.66,9.75 104.85,8.94 59.88,8.94 59.17,8.23 54.7,8.23 42.52,8.23 41.85,8.9 S4.3 37.7,8.9 36.3,7.5 33.6,7.5 32.2,8.9 S4.4
SHIFT_LED  (via drill 0.35, 0.45)
  Top 0.254: v98.77,18.2 101.63,18.2 IC2.27 | v55.63,1.47 54.97,0.81 44.78,0.81 R68.1
  Bottom 0.254: 98.66,18.2 v98.77,18.2 97.31,16.84 97.31,15.83 98.14,14.99 98.14,13.85 99.14,12.85 100.92,12.85 101.3,12.47 101.3,10.89 99.96,9.55 86.43,9.55 84.8,7.92 71.63,7.92 66.95,3.25 57.41,3.25 v55.63,1.47
SLIDE
  Top 0.254: SW3.A2 SW3.A1 257.2,25.65 255.68,27.17 251.23,27.17 248.35,24.29 U1.24
STEP_4
  Top 0.254: S3.3 S3.4 191.57,21.84 194.81,18.59 216.56,18.59 220.01,22.05 222.3,22.05 225.14,19.2 225.14,15.39 229.41,11.12 236.72,11.12 238.1,12.5 238.1,14.48 239.77,16.15 239.77,17.18 U1.9
STEP_8  (via drill 0.41, 0.51)
  Top 0.254: S2.3 S2.4 181.45,21.84 182.78,23.16 191.61,23.16 195.42,19.36 216.46,19.36 220.11,23.01 v231.39,23.01 | U1.2 237.97,23.49 v236.5,23.49 U1.2
  Bottom 0.254: v231.39,23.01 234.74,23.01 235.22,23.49 v236.5,23.49
TIE  (via drill 0.46, 0.51)
  Top 0.254: SW1.A1 SW1.A2 267.7,10.68 v268.58,11.56 | U1.25 245.4,26.66 245.72,26.98 247.85,26.98 v248.46,26.36
  Bottom 0.254: 248.31,26.52 v248.46,26.36 250.59,24.23 263.85,24.23 266.69,27.07 273.51,27.07 274.82,25.76 274.82,12.8 273.58,11.56 v268.58,11.56
VCC
  Top 0.508: IC5.3 263.01,7.2 C6.+ 265.41,10.65 D2.C
VEL_SLIDE  (via drill 0.35, 0.46, 0.6)
  Top 0.254: v56.64,17.09 58.6,17.07 60.1,18.57 64.31,18.57 65.94,16.94 79.83,16.94 80.37,17.48 85.06,17.48 91.97,24.38 100.33,24.38 102.16,22.55 106.12,22.55 111.2,17.48 116.48,17.48 119.22,14.73 v120.29,13.72 | v244.6,26.93 244.6,26.69 U1.26
  Bottom 0.254: VR1.TOP 54.7,19.41 v56.64,17.09 | v120.29,13.72 120.44,13.72 203.65,13.72 203.81,13.87 206.09,16.15 215.71,16.15 215.74,16.18 222.68,16.18 229,9.86 239.26,9.86 241.3,11.89 241.3,19.05 245.87,23.62 245.87,26.06 v244.6,26.93
X0
  Top 0.254: IC6.13 212.65,12.5 211.53,11.38 211.53,7.08 208.09,3.65 203.09,3.65 198.96,3.64 198.37,3.05 186.59,3.05 184.76,1.23 184.76,1.22 180.64,1.22 178.81,3.05 172.31,3.05 172.3,3.05 163.1,3.05 163.09,3.05 142.31,3.05 142.3,3.05 141.63,3.05 141.32,2.74 141.27,2.74 140.46,1.93 135.78,1.93 134.66,3.05 111.9,3.05 111.15,3.81 104.74,3.81 103.98,3.05 97.31,3.05 97.3,3.05 97.13,3.05 95.3,1.22 85.34,1.22 83.51,3.05 59.3,3.05 58.3,4.05 42.41,4.05 40.95,5.51 28.79,5.51 26.26,8.04 25.91,8.04 10.06,8.04 7.68,10.42 7.68,15.12 R1.P$2
X1  (via drill 0.46, 0.51)
  Top 0.254: v216,11.79 215.93,11.85 IC6.14 | v115.82,8.33 115.62,8.13 60.96,8.13 57.88,5.05 43.75,5.05 41.83,6.97 29.54,6.97 27.14,9.37 23.44,9.37 22.68,10.14 22.68,13.7 21.4,14.98 R2.P$2
  Bottom 0.254: 216.05,11.79 v216,11.79 213.36,11.79 212.54,10.97 190.7,10.97 188.06,8.33 181,8.33 178.76,6.1 150.82,6.1 148.59,8.33 127.15,8.33 125.47,6.66 125.47,6.5 120.65,6.5 118.82,8.33 v115.82,8.33
X2
  Top 0.254: R3.P$2 6.09,11.94 6.09,5.49 9.46,2.12 25.7,2.12 26.05,2.46 40.56,2.46 41.65,3.55 56.96,3.55 59.7,0.81 197.99,0.81 200.42,3.24 203.1,3.24 208.26,3.24 212.14,7.11 212.14,10.36 212.97,11.2 IC6.15
X3  (via drill 0.46, 0.6)
  Top 0.254: IC6.12 212.72,13.15 212.68,13.11 211.12,11.55 211.12,7.92 209.29,6.1 v190.19,6.1 | v109.52,5.69 95.7,5.69 93.67,7.72 86.36,7.72 84.33,5.69 59.54,5.69 58.4,4.55 43.45,4.55 41.77,6.23 29.04,6.23 26.47,8.81 22.89,8.81 21.4,10.3 R4.P$2
  Bottom 0.254: v109.52,5.69 109.93,6.1 133.38,6.1 135.2,7.69 139.9,7.66 140.17,7.66 142.19,5.64 179.07,5.64 180.9,7.47 185.98,7.47 187.31,6.15 190.14,6.15 v190.19,6.1 190.4,6.1
X4  (via drill 0.51)
  Top 0.254: IC6.1 221.01,10.55 223.03,8.53 223.31,8.53 249.53,8.53 249.83,8.23 v250.44,8.23
  Bottom 0.254: R5.P$2 285.5,14.53 284.22,13.24 284.22,11.19 284.06,11.03 282.81,11.03 281.38,9.6 276.04,9.6 275.43,10.21 265.99,10.21 265.38,9.6 251.97,9.6 v250.44,8.23
X5  (via drill 0.51)
  Top 0.254: v256.54,7.92 253.22,7.92 252.14,9.01 250.33,9.01 250.26,8.94 223.52,8.94 221.33,11.12 221.33,12.65 220.88,13.11 220.07,13.11 IC6.5
  Bottom 0.254: R6.P$2 301.7,14.53 300.48,13.31 300.48,11.03 299.21,9.75 282.9,9.75 281.68,8.53 275.59,8.53 274.72,9.4 266.32,9.4 265.71,8.79 259.08,8.79 258.98,8.69 257.3,8.69 v256.54,7.92
X6  (via drill 0.51)
  Top 0.254: v251.2,7.47 248.68,7.47 248.09,8.05 220.75,8.05 218.44,10.36 218.44,10.86 218.78,11.2 IC6.2
  Bottom 0.254: R7.P$2 284.63,11.38 284.63,11.03 284.22,10.62 283.01,10.62 281.53,9.14 275.93,9.14 275.27,9.8 266.15,9.8 265.54,9.2 256.44,9.2 256.23,8.99 256.08,8.84 255.47,8.23 251.97,8.23 v251.2,7.47
X7  (via drill 0.46)
  Top 0.254: IC6.4 218.89,12.5 v218.44,12.96
  Bottom 0.254: R8.P$2 301.7,5.23 297.87,1.4 266.99,1.4 266.2,0.61 246.79,0.61 246.2,1.2 238.15,1.2 238.09,1.15 226.66,1.15 224.99,2.82 224.99,10.52 222.55,12.96 v218.44,12.96
XTRA
  Top 0.254: IC2.1 93.26,18.86 92.94,19.18 92.94,21.83 S5.3 S5.4

## Text on the board
tPlace: NEEDLES / ithai benjamin / v2.5 2019 | A RAY CAME DOWN FROM THE SUN
bPlace: TX | GND | +5V | A / RAY / CAME / DOWN / FROM / THE / SUN | +12V | GND | MOSI | +5V | GND | NEEDLES | GND | RES | SCK | ITHAI BENJAMIN v2.5 2018 | MISO
tNames: GND | XTRA
bNames: GND | GND | A7 | A6 | +5V | +5V